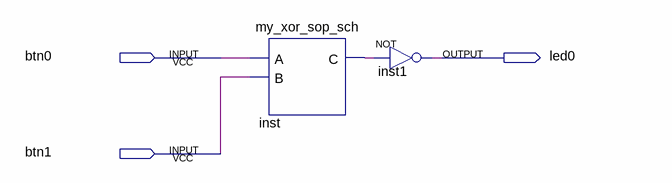
[diagram p0: schematic sheet]
// Quartus schematic tes_my_xor.bdf as structural Verilog: 2 symbols, 3 pins
module tes_my_xor (
  input  btn0,
  input  btn1,
  output led0
);

  wire inst_c;

  my_xor_sop_sch inst (.A(btn0), .B(btn1), .C(inst_c));
  not inst1 (led0, inst_c);
endmodule
